# EAGLE schematic Stereo-Encoder-MC1496 (EAGLE 7.6.0)
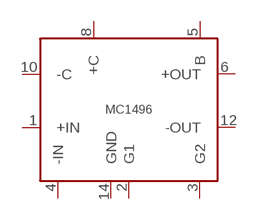
[diagram p0: schematic, sheet 1]

## Parts
U$1  MC1496  [DIL14]
Unconnected: U$1.1(+IN) U$1.2(G1) U$1.3(G2) U$1.4(-IN) U$1.5(B) U$1.6(+OUT) U$1.8(+C) U$1.10(-C) U$1.12(-OUT) U$1.14(GND)

## Library data of the parts
U$1 = mc1496:MC1496